# EAGLE design mainboard (EAGLE 8.6.0)
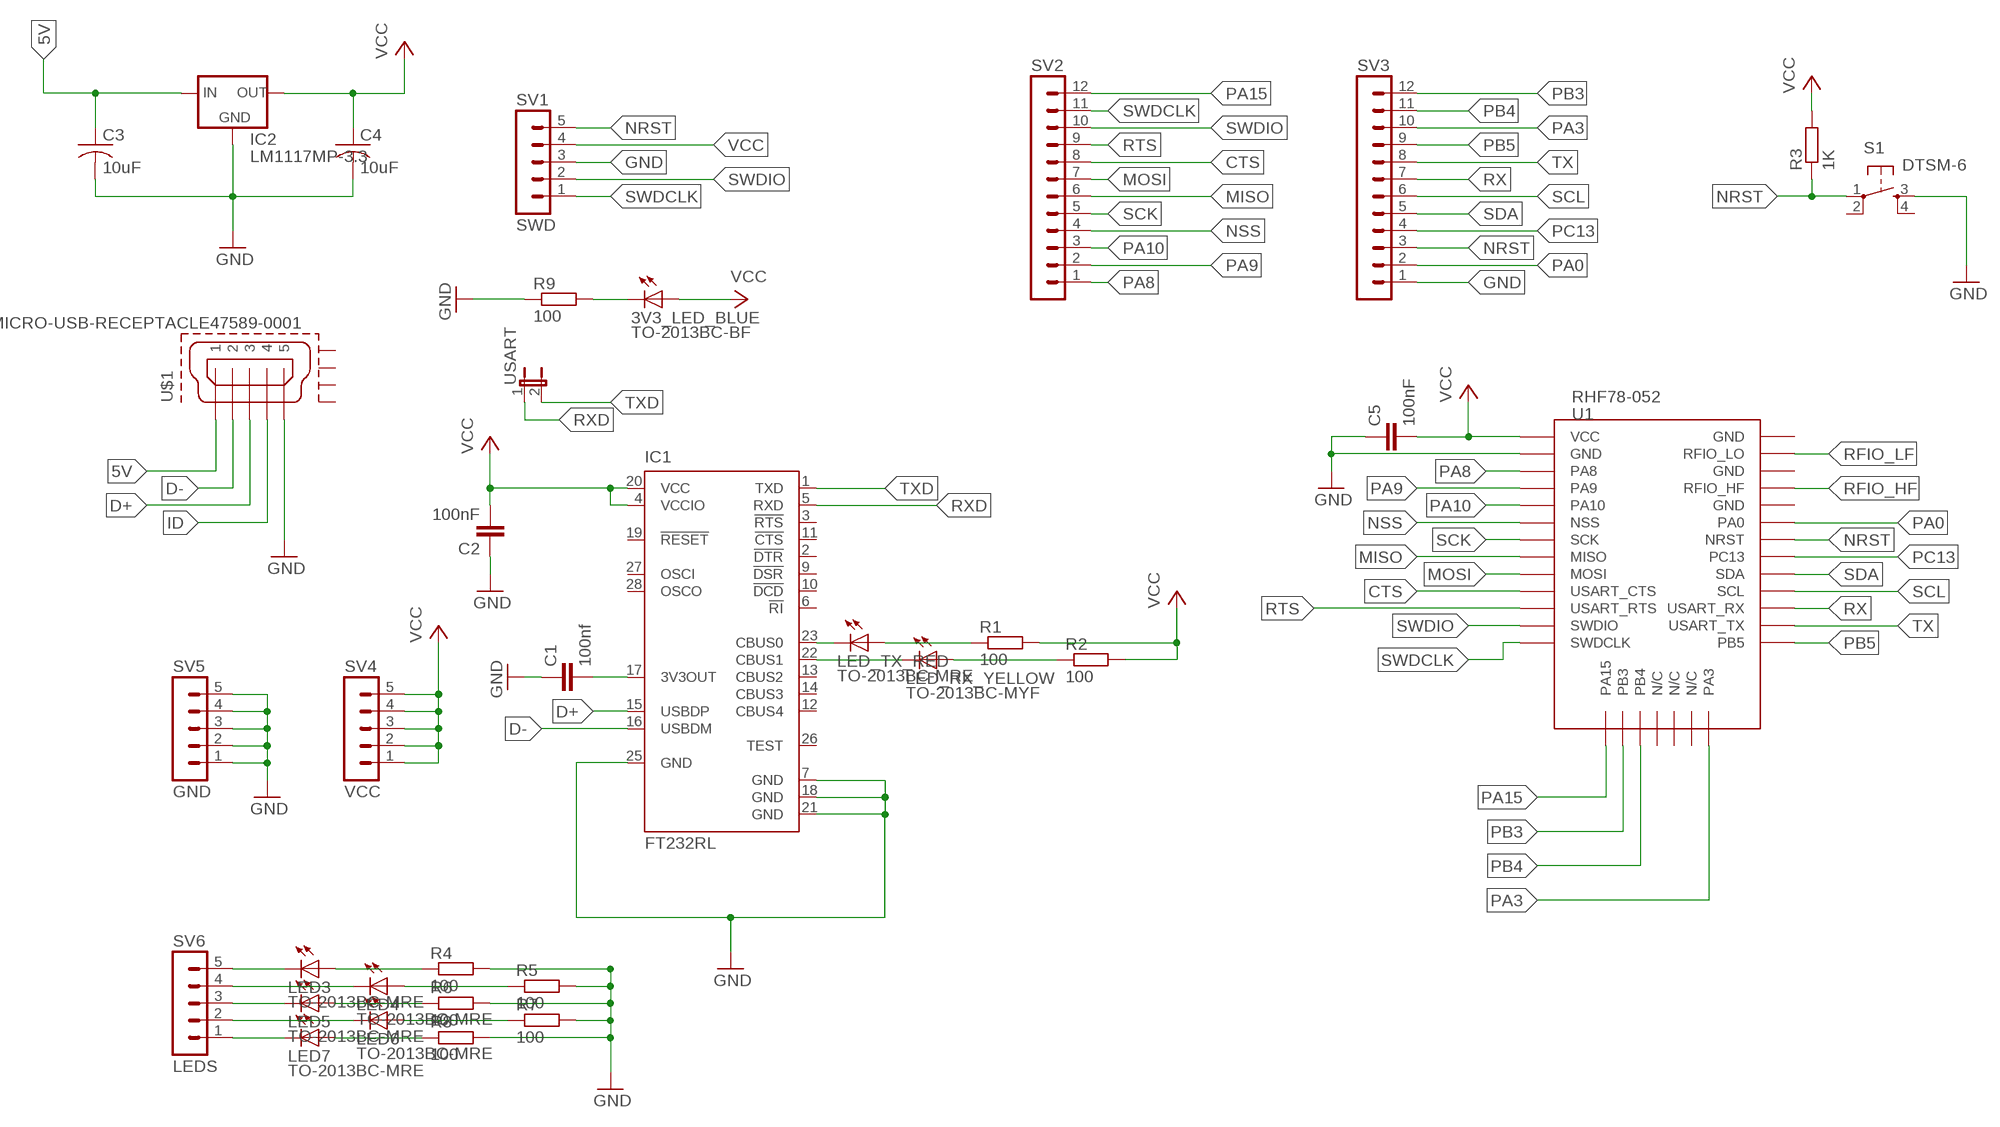
[diagram p0: schematic, sheet 1]

## Parts
3V3_LED_BLUE  TO-2013BC-BF  LEDCHIPLED_1206  [CHIPLED_1206]
C1  100nf  C-EUC1206  [C1206]
C2  100nF  C-EUC1206  [C1206]
C3  10uF  C-USC1206  [C1206]
C4  10uF  C-USC1206  [C1206]
C5  100nF  C-EUC1206  [C1206]
IC1  FT232RL  [SSOP28]
IC2  LM1117MP-3.3  [SOT223]
LED3  TO-2013BC-MRE  LEDCHIPLED_1206  [CHIPLED_1206]
LED4  TO-2013BC-MRE  LEDCHIPLED_1206  [CHIPLED_1206]
LED5  TO-2013BC-MRE  LEDCHIPLED_1206  [CHIPLED_1206]
LED6  TO-2013BC-MRE  LEDCHIPLED_1206  [CHIPLED_1206]
LED7  TO-2013BC-MRE  LEDCHIPLED_1206  [CHIPLED_1206]
LED_RX_YELLOW  TO-2013BC-MYF  LEDCHIPLED_1206  [CHIPLED_1206]
LED_TX_RED  TO-2013BC-MRE  LEDCHIPLED_1206  [CHIPLED_1206]
R1  100  R-EU_R1206  [R1206]
R2  100  R-EU_R1206  [R1206]
R3  1K  R-EU_R1206  [R1206]
R4  100  R-EU_R1206  [R1206]
R5  100  R-EU_R1206  [R1206]
R6  100  R-EU_R1206  [R1206]
R7  100  R-EU_R1206  [R1206]
R8  100  R-EU_R1206  [R1206]
R9  100  R-EU_R1206  [R1206]
S1  DTSM-6  [DTSM-6]
SV1  SWD  MA05-1  [MA05-1]
SV2  MA12-1  [MA12-1]
SV3  MA12-1  [MA12-1]
SV4  VCC  MA05-1  [MA05-1]
SV5  GND  MA05-1  [MA05-1]
SV6  LEDS  MA05-1  [MA05-1]
U1  RHF78-052  [RHF78-052]
U$1  MICRO-USB-RECEPTACLE47589-0001  [47589-0001]
USART  JP1E  [JP1]

## Nets
3V3OUT: C1.2 IC1.17(3V3OUT)
5V: C3.1 IC2.3(IN) U$1.1
CBUS0: IC1.23(CBUS0) LED_TX_RED.C
CBUS1: IC1.22(CBUS1) LED_RX_YELLOW.C
CTS: SV2.8 U1.USART_CTS
D+: IC1.15(USBDP) U$1.3
D-: IC1.16(USBDM) U$1.2
GND: C1.1 C2.1 C3.2 C4.2 C5.1 IC1.7(GND) IC1.18(GND) IC1.21(GND) IC1.25(GND) IC2.1(GND) R4.2 R5.2 R6.2 R7.2 R8.2 R9.1 S1.3 SV1.3 SV3.1 SV5.1 SV5.2 SV5.3 SV5.4 SV5.5 U1.GND@1(GND) U$1.5
ID: U$1.4
MISO: SV2.6 U1.MISO
MOSI: SV2.7 U1.MOSI
N$2: 3V3_LED_BLUE.C R9.2
N$7: LED_TX_RED.A R1.1
N$9: LED_RX_YELLOW.A R2.1
N$12: LED3.C SV6.5
N$13: LED4.C SV6.4
N$14: LED5.C SV6.3
N$15: LED6.C SV6.2
N$16: LED7.C SV6.1
N$17: LED3.A R4.1
N$18: LED4.A R5.1
N$19: LED5.A R6.1
N$20: LED6.A R7.1
N$21: LED7.A R8.1
NRST: R3.1 S1.1 SV1.5 SV3.3 U1.NRST
NSS: SV2.4 U1.NSS
PA0: SV3.2 U1.PA0
PA3: SV3.10 U1.PA3
PA8: SV2.1 U1.PA8
PA9: SV2.2 U1.PA9
PA10: SV2.3 U1.PA10
PA15: SV2.12 U1.PA15
PB3: SV3.12 U1.PB3
PB4: SV3.11 U1.PB4
PB5: SV3.9 U1.PB5
PC13: SV3.4 U1.PC13
RFIO_HF: U1.RFIO_HF
RFIO_LF: U1.RFIO_LF(RFIO_LO)
RTS: SV2.9 U1.USART_RTS
RX: SV3.7 U1.USART_RX
RXD: IC1.5(RXD) USART.1
SCK: SV2.5 U1.SCK
SCL: SV3.6 U1.SCL
SDA: SV3.5 U1.SDA
SWDCLK: SV1.1 SV2.11 U1.SWDCLK
SWDIO: SV1.2 SV2.10 U1.SWDIO
TX: SV3.8 U1.USART_TX
TXD: IC1.1(TXD) USART.2
VCC: 3V3_LED_BLUE.A C2.2 C4.1 C5.2 IC1.4(VCCIO) IC1.20(VCC) IC2.2(OUT) IC2.4(OUT) R1.2 R2.2 R3.2 SV1.4 SV4.1 SV4.2 SV4.3 SV4.4 SV4.5 U1.VCC
Unconnected: IC1.2(!DTR) IC1.3(!RTS) IC1.6(!RI) IC1.9(!DSR) IC1.10(!DCD) IC1.11(!CTS) IC1.12(CBUS4) IC1.13(CBUS2) IC1.14(CBUS3) IC1.19(!RESET) IC1.26(TEST) IC1.27(OSCI) IC1.28(OSCO) S1.2 S1.4 U1.N/C@1(N/C) U1.N/C@2(N/C) U1.N/C@3(N/C) U$1.CASING1(GND1) U$1.CASING2(GND2) U$1.CASING3(GND3) U$1.CASING4(GND4)

## Power pins joined to a net without a drawn wire
GND: U1.GND@2(GND) U1.GND@3(GND) U1.GND@4(GND)

## Library data of the parts
3V3_LED_BLUE LED3-LED7 LED_RX_YELLOW LED_TX_RED = led:LED: LED OSRAM: - CHIPLED LG R971, LG N971, LY N971, LG Q971, LY Q971, LO R971, LY R971 LH N974, LH R974 LS Q976, LO Q976, LY Q976 LO Q996 - Hyper CHIPLED LW Q18S LB Q993, LB Q99A, LB R99A - SideLED LS A670, LO A670, LY A670, LG A670, LP A670 LB A673, LV A673, LT A673, LW A673 LH A674 LY A675 LS A676, LA A676, LO A676, LY A676, LW A676 LS A679, LY A679, LG A679 - Hyper Micro SIDELED® LS Y876, LA Y876, LO Y876, LY Y876 LT Y87S - SmartLED LW L88C, LW L88S LB L89C, LB L89S, LG L890 LS L89K, LO L89K, LY L89K LS L896, LA L896, LO L896, LY L896 - TOPLED LS T670, LO T670, LY T670, LG T670, LP T670 LSG T670, LSP T670, LSY T670, LOP T670, LYG T670 LG T671, LOG T671, LSG T671 LB T673, LV T673, LT T673, LW T673 LH T674 LS T676, LA T676, LO T676, LY T676, LB T676, LH T676, LSB T676, LW T676 LB T67C, LV T67C, LT T67C, LS T67K, LO T67K, LY T67K, LW E67C LS E67B, LA E67B, LO E67B, LY E67B, LB E67C, LV E67C, LT E67C LW T67C LS T679, LY T679, LG T679 LS T770, LO T770, LY T770, LG T770, LP T770 LB T773, LV T773, LT T773, LW T773 LH T774 LS E675, LA E675, LY E675, LS T675 LS T776, LA T776, LO T776, LY T776, LB T776 LHGB T686 LT T68C, LB T68C - Hyper Mini TOPLED® LB M676 - Mini TOPLED Santana® LG M470 LS M47K, LO M47K, LY M47K Source: http://www.osram.convergy.de LUXEON: - LUMILED® LXK2-PW12-R00, LXK2-PW12-S00, LXK2-PW14-U00, LXK2-PW14-V00 LXK2-PM12-R00, LXK2-PM12-S00, LXK2-PM14-U00 LXK2-PE12-Q00, LXK2-PE12-R00, LXK2-PE12-S00, LXK2-PE14-T00, LXK2-PE14-U00 LXK2-PB12-K00, LXK2-PB12-L00, LXK2-PB12-M00, LXK2-PB14-N00, LXK2-PB14-P00, LXK2-PB14-Q00 LXK2-PR12-L00, LXK2-PR12-M00, LXK2-PR14-Q00, LXK2-PR14-R00 LXK2-PD12-Q00, LXK2-PD12-R00, LXK2-PD12-S00 LXK2-PH12-R00, LXK2-PH12-S00 LXK2-PL12-P00, LXK2-PL12-Q00, LXK2-PL12-R00 Source: www.luxeon.com KINGBRIGHT: KA-3528ASYC Source: www.kingbright.com
C1 C2 C5 = rcl:C-EU: CAPACITOR, European symbol; SPICEPREFIX: C
C3 C4 = rcl:C-US: CAPACITOR, American symbol; SPICEPREFIX: C
IC1 = ftdichip:FT232R: Source: http://www.ftdichip.com/Documents/DataSheets/DS_FT232R_v104.pdf; MPN: FT232RL; OC_FARNELL: 1146032; OC_NEWARK: 91K9918
IC2 = lm1117_10:LM1117?-*: 800mA Low-Dropout Linear Regulator Source: http://www.ti.com/lit/ds/symlink/lm1117-n.pdf; MF: Texas Instruments; MPN: LM1117MP-3.3; OC_FARNELL: 9778195; OC_NEWARK: 28X3416
R1-R9 = rcl:R-EU_: RESISTOR, European symbol; SPICEPREFIX: R
S1 = switch-tact:DTSM-6
SV1 SV4-SV6 = con-lstb:MA05-1: PIN HEADER; OC_FARNELL: unknown; OC_NEWARK: unknown
SV2 SV3 = con-lstb:MA12-1: PIN HEADER; OC_FARNELL: unknown; OC_NEWARK: unknown
U1 = RHF78-052:RHF78-052
U$1 = con-molex-usb:MICRO-USB-RECEPTACLE: MICRO USB RECEPTACLES Micro-USB Receptacles, SMT, Lead-Free from MOLEX <http://www.molex.com/>. (C) 2014 Tomasz Boleslaw CEDRO, cederom@tlen.pl, http://www.tomek.cedro.info. Version 0.1 (2014-01-17): Initial release. Version 0.2 (2014-02-06): Updated 47589-0001 footprint pins/pads/milling. Following devices are included: 1. 47589-0001 Micro-USB AB Receptacle, Bottom Mount, SMT, Lead-Free <http://www.molex.com/molex/products/datasheet.jsp?part=active/0475890001_IO_CONNECTORS.xml> (Technical Drawing <http://www.molex.com/pdm_docs/sd/475890001_sd.pdf>).
USART = jumper:JP1E: JUMPER

## Board
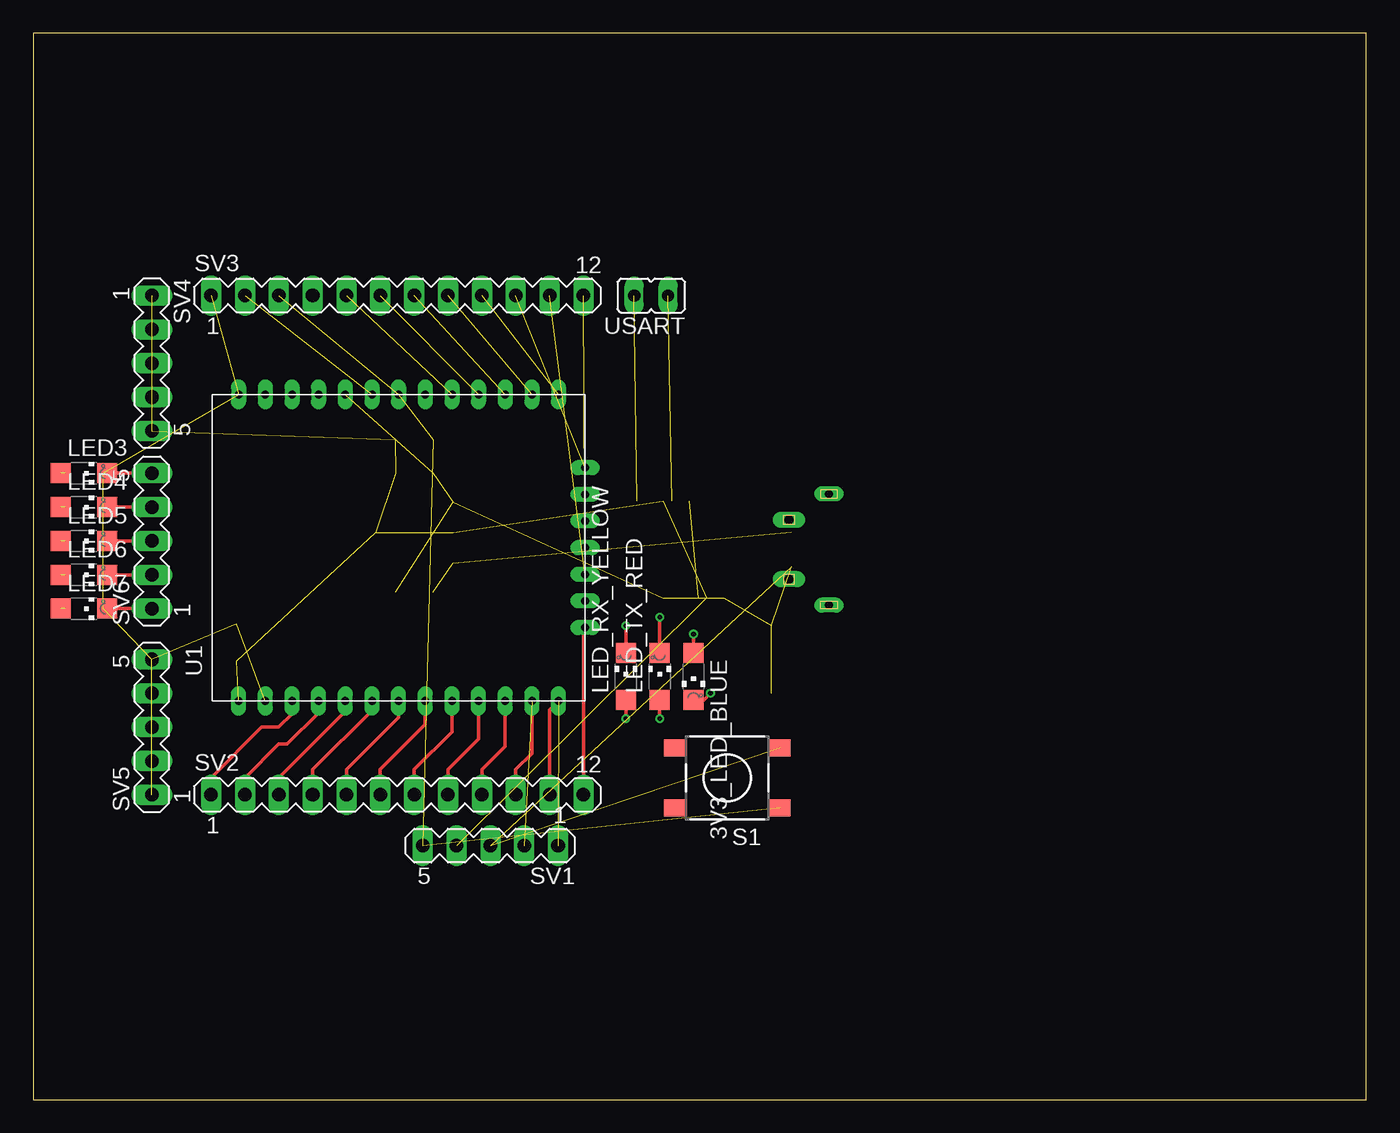
[diagram p1: board, top side]
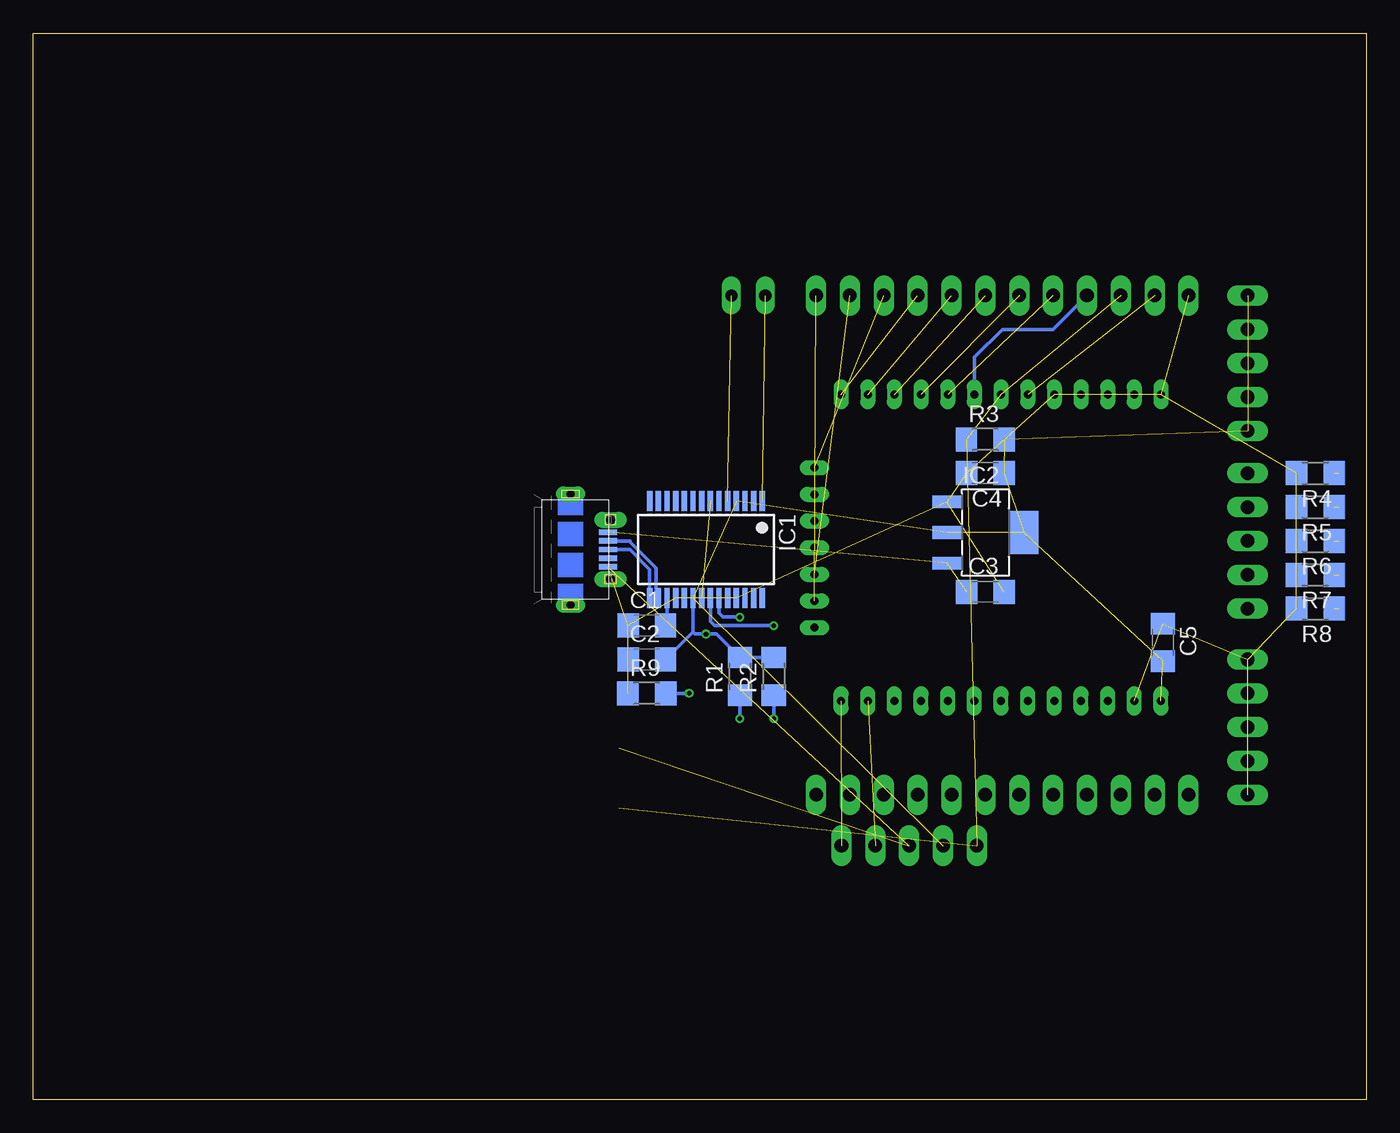
[diagram p2: board, bottom side, seen from below]

Size 100 x 80 mm. Coordinates in mm from the lower left corner, seen from the top.
Outline: 0,0 100,0 100,80 0,80 0,0
Copper layers (1*16): Top 0.035mm / dielectric 1.5mm / Bottom 0.035mm
Design rules "dirt_cheap_dirty_boards.v1.1": minimum track width 6mil, minimum drill 12mil, track to track 6mil, track to pad 6mil, pad to pad 6mil, via to via 6mil, smd to smd 0mil, copper to edge 10mil, drill to drill 10mil, minimum pad ring 10mil, minimum via ring 6mil, stop-mask expansion 2mil, vias tented up to drill 25mil, thermal gap 10mil

### Footprints (pad centres in the part's own frame; a part is rotated, then mirrored left to right if it is on the bottom)
CHIPLED_1206 = smd 1.5 x 1.5: A 0,-1.75; C 0,1.75
C1206 = smd 1.6 x 1.8: 1 -1.4,0; 2 1.4,0
SSOP28 = smd 0.4 x 1.5: 1 -4.225,-3.625; 2 -3.575,-3.625; 3 -2.925,-3.625; 4 -2.275,-3.625; 5 -1.625,-3.625; 6 -0.975,-3.625; 7 -0.325,-3.625; 8 0.325,-3.625; 9 0.975,-3.625; 10 1.625,-3.625; 11 2.275,-3.625; 12 2.925,-3.625; 13 3.575,-3.625; 14 4.225,-3.625; 15 4.225,3.625; 16 3.575,3.625; 17 2.925,3.625; 18 2.275,3.625; 19 1.625,3.625; 20 0.975,3.625; 21 0.325,3.625; 22 -0.325,3.625; 23 -0.975,3.625; 24 -1.625,3.625; 25 -2.275,3.625; 26 -2.925,3.625; 27 -3.575,3.625; 28 -4.225,3.625
SOT223 = smd 0.95 x 2.15: 1 -2.3,-2.9; 2 0,-2.9; 3 2.3,-2.9 | smd 3.25 x 2.15: 4 0,2.9
R1206 = smd 1.6 x 1.803: 1 -1.422,0; 2 1.422,0
DTSM-6 = smd 1.55 x 1.3: 1 -3.975,2.25; 2 3.975,2.25; 3 -3.975,-2.25; 4 3.975,-2.25
MA05-1 = drill 1.016 long: 1 -5.08,0; 2 -2.54,0; 3 0,0; 4 2.54,0; 5 5.08,0
MA12-1 = drill 1.016 long: 1 -13.97,0; 2 -11.43,0; 3 -8.89,0; 4 -6.35,0; 5 -3.81,0; 6 -1.27,0; 7 1.27,0; 8 3.81,0; 9 6.35,0; 10 8.89,0; 11 11.43,0; 12 13.97,0
RHF78-052 = drill 0.6 long: GND@1 -12,8; GND@2 11,2; GND@3 11,6; GND@4 11,10; MISO -12,-4; MOSI -12,-6; N/C@1 -0.5,-16; N/C@2 1.5,-16; N/C@3 3.5,-16; NRST 11,-2; NSS -12,0; PA0 11,0; PA3 5.5,-16; PA8 -12,6; PA9 -12,4; PA10 -12,2; PA15 -6.5,-16; PB3 -4.5,-16; PB4 -2.5,-16; PB5 11,-14; PC13 11,-4; RFIO_HF 11,4; RFIO_LF 11,8; SCK -12,-2; SCL 11,-8; SDA 11,-6; SWDCLK -12,-14; SWDIO -12,-12; USART_CTS -12,-8; USART_RTS -12,-10; USART_RX 11,-10; USART_TX 11,-12; VCC -12,10
47589-0001 = smd 1.35 x 0.4: 1 2.8,1.3; 2 2.8,0.65; 3 2.8,0; 4 2.8,-0.65; 5 2.8,-1.3 | drill 0.6 pad 0.95 long: CASING1 0,4.175; CASING2 0,-4.175 | drill 0.7 pad 1.1 long: CASING3 3,2.225; CASING4 3,-2.225
JP1 = drill 0.914 long: 1 0,-1.27; 2 0,1.27

### Placement (x,y rotation side)
3V3_LED_BLUE  49.53,31.75 180 top
C1  53.98,35.56 0 bottom
C2  53.98,33.02 0 bottom
C3  28.57,38.1 0 bottom
C4  28.57,46.99 180 bottom
C5  15.24,34.29 270 bottom
IC1  49.53,41.27 180 bottom
IC2  28.57,42.55 270 bottom
LED3  3.81,46.99 270 top
LED4  3.81,44.45 270 top
LED5  3.81,41.91 270 top
LED6  3.81,39.37 270 top
LED7  3.81,36.83 270 top
LED_RX_YELLOW  44.45,31.75 0 top
LED_TX_RED  46.99,31.75 0 top
R1  46.99,31.75 90 bottom
R2  44.45,31.75 90 bottom
R3  28.57,49.53 0 bottom
R4  3.81,46.99 180 bottom
R5  3.81,44.45 180 bottom
R6  3.81,41.91 180 bottom
R7  3.81,39.37 180 bottom
R8  3.81,36.83 180 bottom
R9  53.98,30.48 0 bottom
S1  52.07,24.13 180 top
SV1  34.29,19.05 180 top
SV2  27.3,22.86 0 top
SV3  27.3,60.33 0 top
SV4  8.89,55.24 270 top
SV5  8.89,27.94 90 top
SV6  8.89,41.91 90 top
U1  25.4,41.91 90 top
U$1  59.69,41.27 0 bottom
USART  46.35,60.33 90 top

### Tracks (layer width: path | path; a pad name or v marks a point on that pad's centre or on a via)
3V3OUT
  Bottom 0.254: IC1.17 52.45,35.68 C1.2
5V  (2 unrouted)
CBUS0  (via drill 0.35)
  Top 0.254: LED_TX_RED.C v46.99,36.2
  Bottom 0.254: IC1.23 48.55,36.49 48.26,36.2 v46.99,36.2
CBUS1  (via drill 0.35)
  Top 0.254: LED_RX_YELLOW.C v44.45,35.56
  Bottom 0.254: IC1.22 49.2,35.87 48.9,35.56 v44.45,35.56
CTS
  Top 0.254: U1.USART_CTS 33.4,27.05 31.11,24.77 SV2.8
D+
  Bottom 0.254: IC1.15 53.76,39.78 55.24,41.27 U$1.3
D-
  Bottom 0.254: IC1.16 53.28,37.82 53.28,39.88 55.24,41.85 55.24,41.91 55.26,41.92 U$1.2
GND  (28 unrouted)
MISO
  Top 0.254: U1.MISO 29.4,28.13 26.04,24.77 SV2.6
MOSI
  Top 0.254: U1.MOSI 31.4,27.59 28.57,24.77 SV2.7
N$2  (via drill 0.35)
  Top 0.254: 3V3_LED_BLUE.C 50.32,30 v50.8,30.48
  Bottom 0.254: v50.8,30.48 R9.2
N$7  (via drill 0.35)
  Top 0.254: LED_TX_RED.A v46.99,28.57
  Bottom 0.254: v46.99,28.57 R1.1
N$9  (via drill 0.35)
  Top 0.254: LED_RX_YELLOW.A v44.45,28.57
  Bottom 0.254: v44.45,28.57 R2.1
N$12
  Top 0.254: SV6.5 LED3.C
N$13
  Top 0.254: SV6.4 LED4.C
N$14
  Top 0.254: SV6.3 LED5.C
N$15
  Top 0.254: SV6.2 LED6.C
N$16
  Top 0.254: SV6.1 LED7.C
N$17  (1 unrouted)
N$18  (1 unrouted)
N$19  (1 unrouted)
N$20  (1 unrouted)
N$21  (1 unrouted)
NRST  (4 unrouted)
NSS
  Top 0.254: U1.NSS 25.4,29.21 20.95,24.77 SV2.4
PA0  (1 unrouted)
PA3  (1 unrouted)
PA8
  Top 0.254: SV2.1 13.34,24.13 17.14,27.94 18.41,27.94 19.4,28.93 U1.PA8
PA9
  Top 0.254: SV2.2 15.88,24.13 18.41,26.67 19.05,26.67 21.4,29.02 U1.PA9
PA10
  Top 0.254: U1.PA10 23.4,29.11 18.41,24.13 SV2.3
  Bottom 0.254: 18.41,23.5 SV2.3
PA15
  Top 0.254: U1.PA15 41.27,35.28 SV2.12
PB3  (1 unrouted)
PB4  (1 unrouted)
PB5  (1 unrouted)
PC13
  Bottom 0.254: SV3.4 23.5,57.78 27.3,57.78 29.4,55.69 U1.PC13
RTS
  Top 0.254: U1.USART_RTS 35.4,26.51 33.66,24.77 SV2.9
RX  (1 unrouted)
RXD  (1 unrouted)
SCK
  Top 0.254: U1.SCK 27.4,28.67 23.5,24.77 SV2.5
SCL  (1 unrouted)
SDA  (1 unrouted)
SWDCLK  (1 unrouted)
  Top 0.254: U1.SWDCLK 38.73,29.25 SV2.11
SWDIO  (1 unrouted)
  Top 0.254: U1.SWDIO 37.4,25.97 36.2,24.77 SV2.10
TX  (1 unrouted)
TXD  (1 unrouted)
VCC  (via drill 0.35)  (13 unrouted)
  Top 0.254: 3V3_LED_BLUE.A v49.53,34.92
  Bottom 0.254: C2.2 50.51,35.09 | 50.51,35.09 IC1.20 | 50.51,35.09 50.34,34.92 v49.53,34.92 48.74,34.92 R1.2 R2.2